# EAGLE schematic Camera_board (EAGLE 6.6.0)
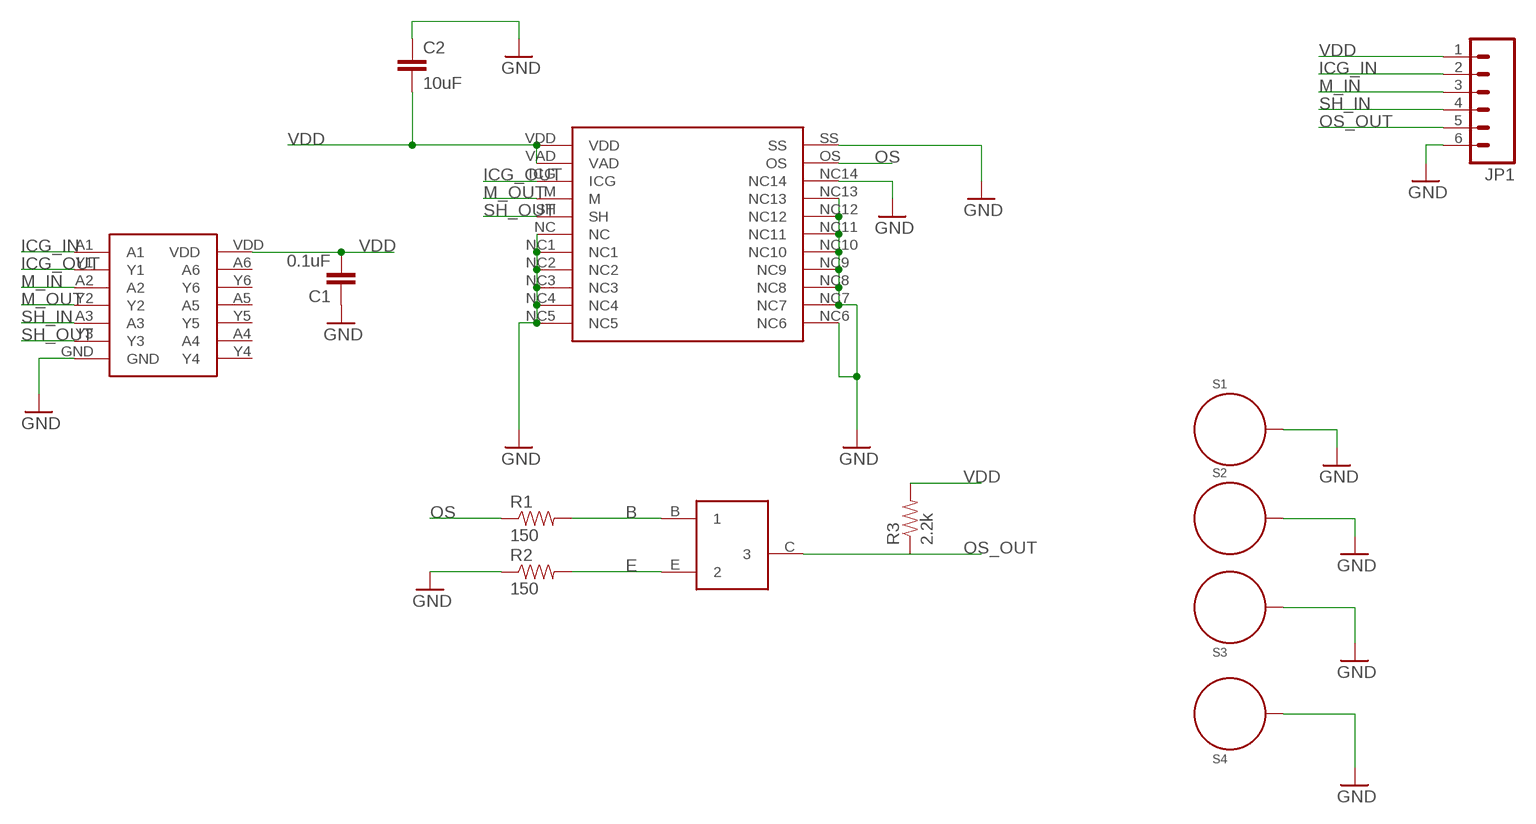
[diagram p0: schematic, sheet 1]

## Parts
C1  0.1uF  CAP1206  [1206]
C2  10uF  CAP1206  [1206]
JP1  M06LONGPADS  [1X06_LONGPADS]
R1  150  RESISTOR1206  [1206]
R2  150  RESISTOR1206  [1206]
R3  2.2k  RESISTOR1206  [1206]
S1  STANDOFF_ELECTRICAL  [STANDOFF-ELECTRICAL]
S2  STANDOFF_ELECTRICAL  [STANDOFF-ELECTRICAL]
S3  STANDOFF_ELECTRICAL  [STANDOFF-ELECTRICAL]
S4  STANDOFF_ELECTRICAL  [STANDOFF-ELECTRICAL]
U$1  TRANSISTOR  [SOT23-BEC]
U$2  CCDCAMERA  [CCDCAMERA]
U$3  CMOS_HEX_INVERTER  [CMOS_HEX_INVERTER]

## Nets
B: R1.2 U$1.B
E: R2.2 U$1.E
GND: C1.1 C2.1 JP1.6 R2.1 S1.P1 S2.P1 S3.P1 S4.P1 U$2.NC U$2.NC1 U$2.NC2 U$2.NC3 U$2.NC4 U$2.NC5 U$2.NC6 U$2.NC7 U$2.NC8 U$2.NC9 U$2.NC10 U$2.NC11 U$2.NC12 U$2.NC13 U$2.NC14 U$2.SS U$3.GND
ICG_IN: U$3.A1
ICG_OUT: U$2.ICG
M_OUT: U$2.M
OS: R1.1
OS_OUT: U$1.C
SH_IN: U$3.A3
SH_OUT: U$2.SH
VDD: C1.2 C2.2 R3.2 U$2.VAD U$2.VDD U$3.VDD
Unconnected: JP1.1 JP1.2 JP1.3 JP1.4 JP1.5 R3.1 U$2.OS U$3.A2 U$3.A4 U$3.A5 U$3.A6 U$3.Y1 U$3.Y2 U$3.Y3 U$3.Y4 U$3.Y5 U$3.Y6

## Library data of the parts
C1 C2 = SparkFun-Capacitors:CAP: Capacitor Standard 0603 ceramic capacitor, and 0.1" leaded capacitor.
JP1 = SparkFun-Connectors:M06: Header 6 Standard 6-pin 0.1" header. Use with straight break away headers (SKU : PRT-00116), right angle break away headers (PRT-00553), swiss pins (PRT-00743), machine pins (PRT-00117), and female headers (PRT-00115). Molex polarized connector foot print use with SKU : PRT-08094 with associated crimp pins and housings. NOTES ON THE VARIANTS LOCK and LOCK_LONGPADS... This footprint was designed to help hold the alignment of a through-hole component (i.e. 6-pin header) while soldering it into place. You may notice that each hole has been shifted either up or down by 0.005 of an inch from it's more standard position (which is a perfectly straight line). This slight alteration caused the pins (the squares in the middle) to touch the edges of the holes. Because they are alternating, it causes a "brace" to hold the component in place. 0.005 has proven to be the perfect amount of "off-center" position when using our standard breakaway headers. Although looks a little odd when you look at the bare footprint, once you have a header in there, the alteration is very hard to notice. Also,if you push a header all the way into place, it is covered up entirely on the bottom side. This idea of altering the position of holes to aid alignment will be further integrated into the Sparkfun Library for other footprints. It can help hold any component with 3 or more connection pins.
R1-R3 = SparkFun-Resistors:RESISTOR: Resistor Basic schematic elements and footprints for 0603, 1206, and PTH resistors.
S1-S4 = SparkFun-Electromechanical:STANDOFF_ELECTRICAL: A standoff intended to be an electrically connected point. Pad size and stop size allow for a #4 Phillips pan screw head to make a solid connection to the board.
U$1 = SCIENCE_BOARD:TRANSISTOR
U$2 = CCDCAMERA (1):CCDCAMERA
U$3 = SCIENCE_BOARD:CMOS_HEX_INVERTER